# Altium project NC1-1BA.PrjPcb (part 2 of 2)

## Sheet Power.SchDoc: On / Off Controller
size A3; SheetNumber: 7; SheetTotal: 7
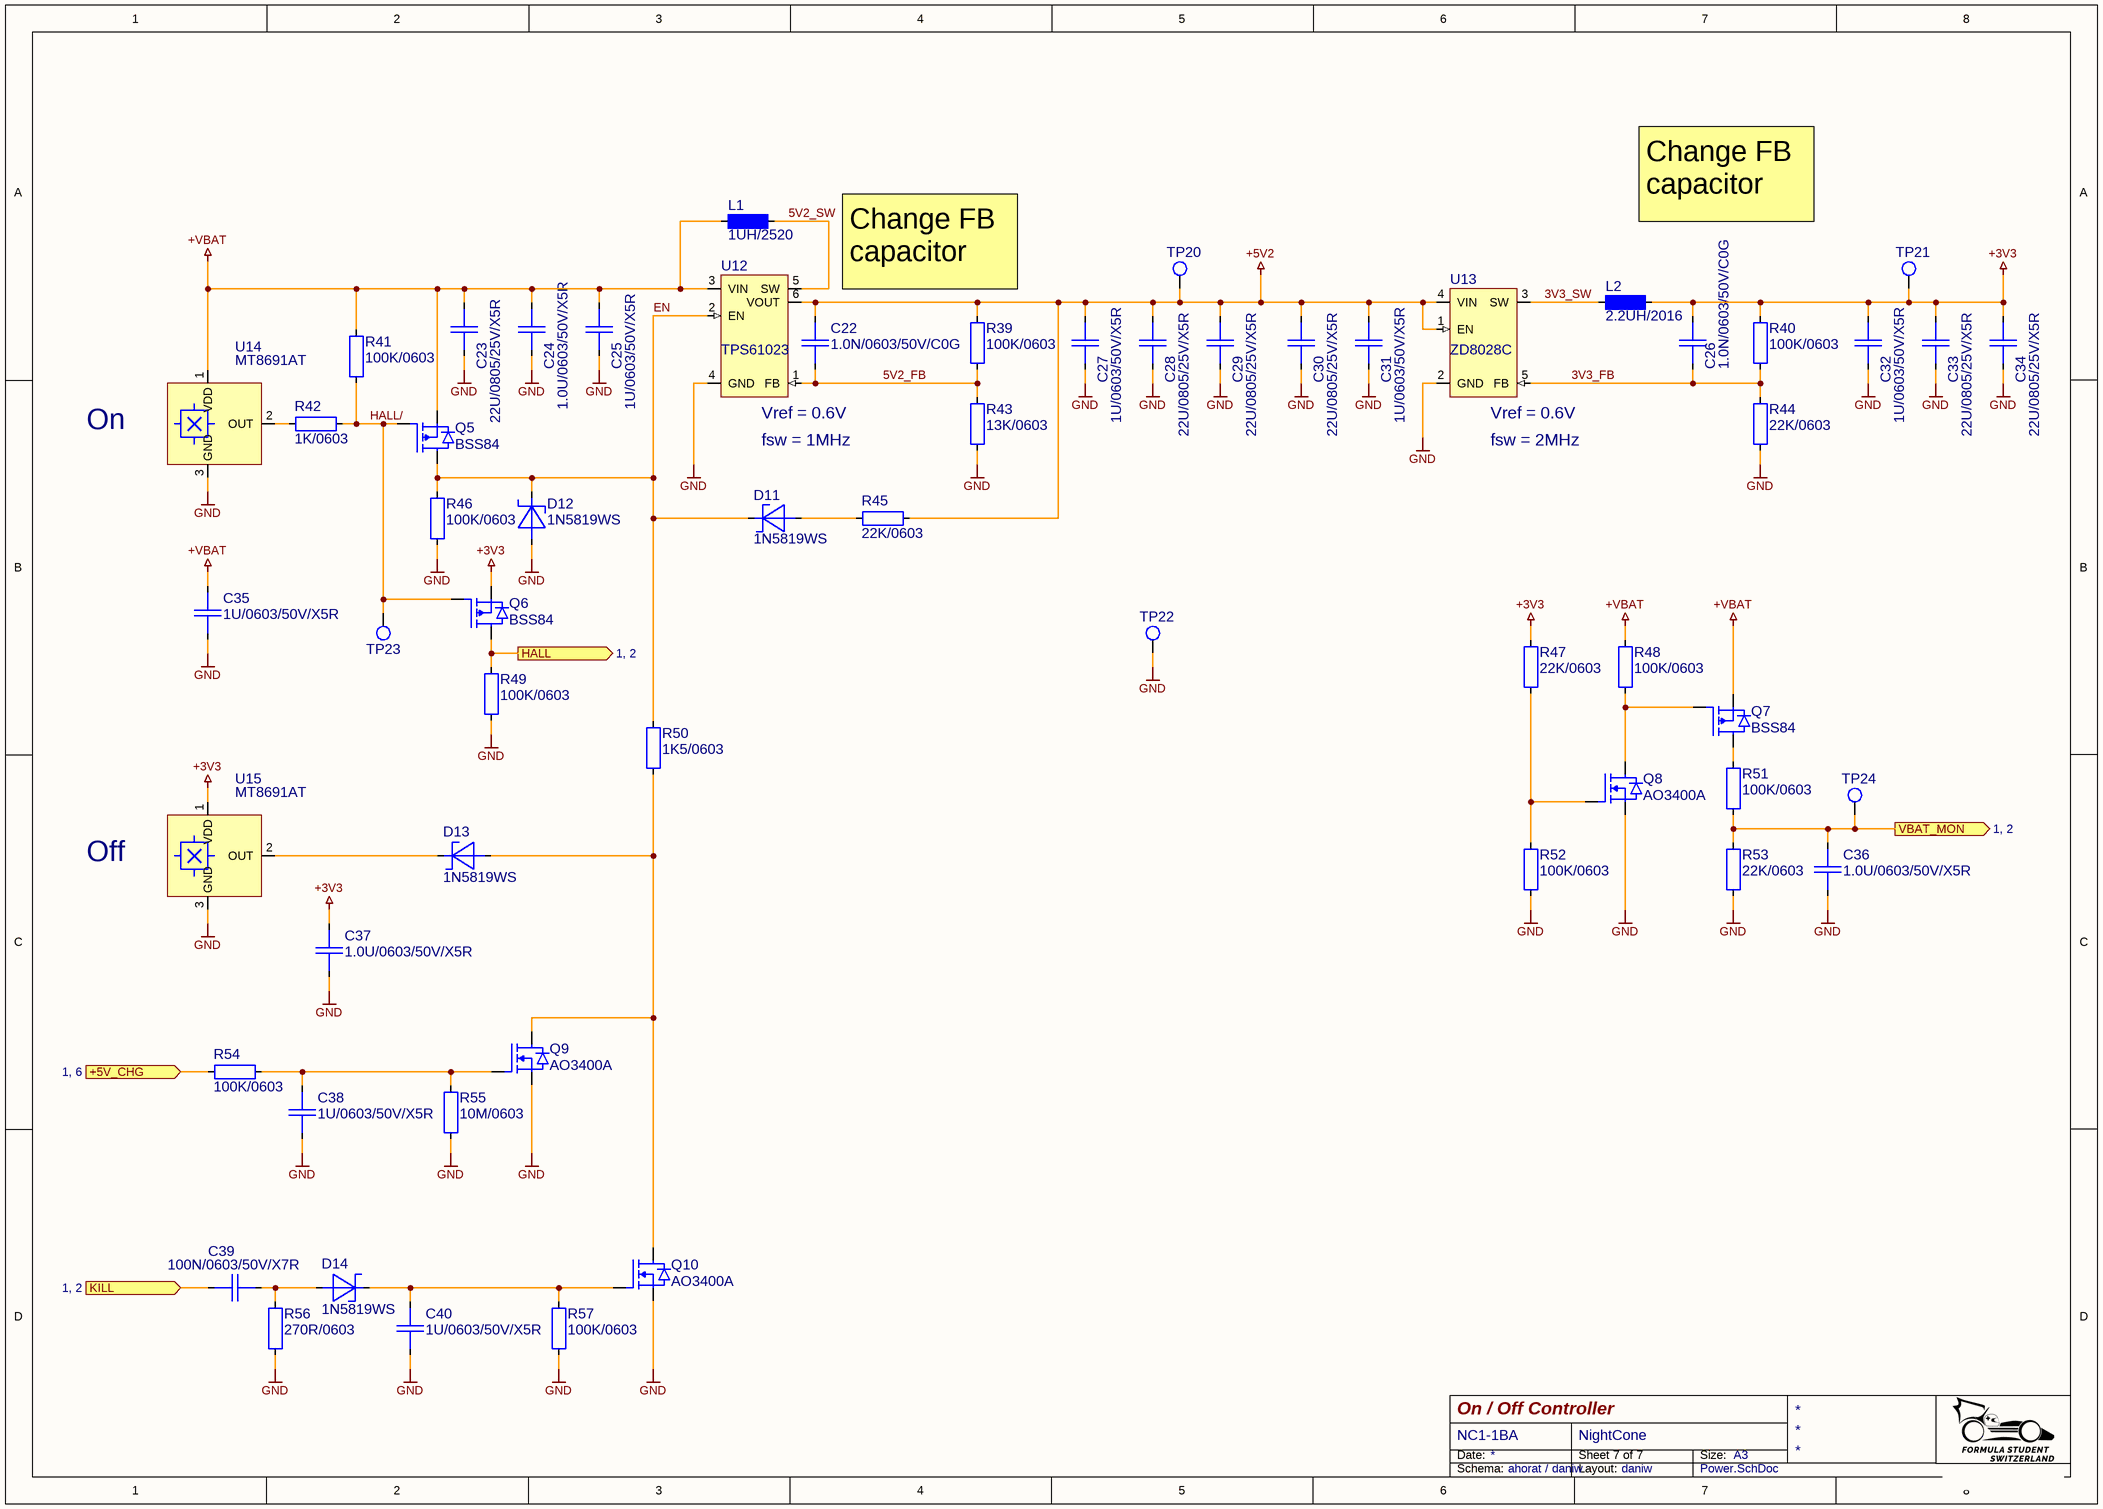
[diagram p6: Power.SchDoc]

### Parts
C22  1.0N/0603/50V/C0G  [CAP0603_C0G]
C23  22U/0805/25V/X5R  [CAP0805_X7R]
C24  1.0U/0603/50V/X5R  [CAP0603_X7R]
C25  1U/0603/50V/X5R  [CAP0603_X7R]
C26  1.0N/0603/50V/C0G  [CAP0603_C0G]
C27  1U/0603/50V/X5R  [CAP0603_X7R]
C28  22U/0805/25V/X5R  [CAP0805_X7R]
C29  22U/0805/25V/X5R  [CAP0805_X7R]
C30  22U/0805/25V/X5R  [CAP0805_X7R]
C31  1U/0603/50V/X5R  [CAP0603_X7R]
C32  1U/0603/50V/X5R  [CAP0603_X7R]
C33  22U/0805/25V/X5R  [CAP0805_X7R]
C34  22U/0805/25V/X5R  [CAP0805_X7R]
C35  1U/0603/50V/X5R  [CAP0603_X7R]
C36  1.0U/0603/50V/X5R  [CAP0603_X7R]
C37  1.0U/0603/50V/X5R  [CAP0603_X7R]
C38  1U/0603/50V/X5R  [CAP0603_X7R]
C39  100N/0603/50V/X7R  [CAP0603_X7R]
C40  1U/0603/50V/X5R  [CAP0603_X7R]
D11  1N5819WS  [SOD2513X100]
D12  1N5819WS  [SOD2513X100]
D13  1N5819WS  [SOD2513X100]
D14  1N5819WS  [SOD2513X100]
L1  1UH/2520  [INDM2520X10]
L2  2.2UH/2016  [INDM2016X10]
Q5  BSS84  [SOT2395P280X125-3-SE]
Q6  BSS84  [SOT2395P280X125-3-SE]
Q7  BSS84  [SOT2395P280X125-3-SE]
Q8  AO3400A  [SOT2395P280X125-3-SE]
Q9  AO3400A  [SOT2395P280X125-3-SE]
Q10  AO3400A  [SOT2395P280X125-3-SE]
R39  100K/0603  [R0603-0.40-WW]
R40  100K/0603  [R0603-0.40-WW]
R41  100K/0603  [R0603-0.40-WW]
R42  1K/0603  [R0603-0.40-WW]
R43  13K/0603  [R0603-0.40-WW]
R44  22K/0603  [R0603-0.40-WW]
R45  22K/0603  [R0603-0.40-WW]
R46  100K/0603  [R0603-0.40-WW]
R47  22K/0603  [R0603-0.40-WW]
R48  100K/0603  [R0603-0.40-WW]
R49  100K/0603  [R0603-0.40-WW]
R50  1K5/0603  [R0603-0.40-WW]
R51  100K/0603  [R0603-0.40-WW]
R52  100K/0603  [R0603-0.40-WW]
R53  22K/0603  [R0603-0.40-WW]
R54  100K/0603  [R0603-0.40-WW]
R55  10M/0603  [R0603-0.40-WW]
R56  270R/0603  [R0603-0.40-WW]
R57  100K/0603  [R0603-0.40-WW]
TP20  TP_THD_1.5/0.8  [TP_THD_1.5/0.8]  (value not drawn)  (no BOM)
TP21  TP_THD_1.5/0.8  [TP_THD_1.5/0.8]  (value not drawn)  (no BOM)
TP22  TP_THD_1.5/0.8  [TP_THD_1.5/0.8]  (value not drawn)  (no BOM)
TP23  TP_THD_1.5/0.8  [TP_THD_1.5/0.8]  (value not drawn)  (no BOM)
TP24  TP_THD_1.5/0.8  [TP_THD_1.5/0.8]  (value not drawn)  (no BOM)
U12  TPS61023  [SOT50P160X60-6-SE]
U13  ZD8028C  [SOT2395P280X125-5-SW]
U14  MT8691AT  [SOT2395P280X125-3-SE]
U15  MT8691AT  [SOT2395P280X125-3-SE]

### Ports
+5V_CHG (in, see 1, 6), HALL (out, see 1, 2), KILL (in, see 1, 2), VBAT_MON (out, see 1, 2)

### Nets
+3V3: C26.1 C32.2 C33.1 C34.1 C37.1 L2.2 Q6.2(SOURCE) R40.1 R47.1 TP21.1 U15.1(VDD)
+5V2: C22.1 C27.2 C28.1 C29.1 C30.1 C31.2 R39.1 R45.2 TP20.1 U12.6(VOUT) U13.1(EN) U13.4(VIN)
+VBAT: C23.1 C24.2 C25.2 C35.1 L1.1 Q5.2(SOURCE) Q7.2(SOURCE) R41.1 R48.1 U12.3(VIN) U14.1(VDD)
GND: C23.2 C24.1 C25.1 C27.1 C28.2 C29.2 C30.2 C31.1 C32.1 C33.2 C34.2 C35.2 C36.2 C37.2 C38.2 C40.2 D12.2 Q8.2(SOURCE) Q9.2(SOURCE) Q10.2(SOURCE) R43.1 R44.2 R46.2 R49.2 R52.2 R53.2 R55.2 R56.2 R57.2 TP22.1 U12.4(GND) U13.2(GND) U14.3(GND) U15.3(GND)
3V3_FB: C26.2 R40.2 R44.1 U13.5(FB)
3V3_SW: L2.1 U13.3(SW)
5V2_FB: C22.2 R39.2 R43.2 U12.1(FB)
5V2_SW: L1.2 U12.5(SW)
+5V_CHG: R54.1 ; port +5V_CHG
EN: D11.1 D12.1 Q5.3(DRAIN) R46.1 R50.1 U12.2(EN)
HALL: Q6.3(DRAIN) R49.1 ; port HALL
HALL/: Q5.1(GATE) Q6.1(GATE) R41.2 R42.2 TP23.1
KILL: C39.1 ; port KILL
VBAT_MON: C36.1 R51.2 R53.1 TP24.1 ; port VBAT_MON
NetC38_1: C38.1 Q9.1(GATE) R54.2 R55.1
NetC39_2: C39.2 D14.2 R56.1
NetC40_1: C40.1 D14.1 Q10.1(GATE) R57.1
NetD11_2: D11.2 R45.1
NetD13_1: D13.1 U15.2(OUT)
NetD13_2: D13.2 Q9.3(DRAIN) Q10.3(DRAIN) R50.2
NetQ7_1: Q7.1(GATE) Q8.3(DRAIN) R48.2
NetQ7_3: Q7.3(DRAIN) R51.1
NetQ8_1: Q8.1(GATE) R47.2 R52.1
NetR42_1: R42.1 U14.2(OUT)

### Notes on the sheet
- Change FB capacitor
- On
- (near U12) Vref = 0.6V
- fsw = 1MHz
- (near U13) Vref = 0.6V
- (near U13) fsw = 2MHz
- Off
- Date:
- Size:
- A3
- Schema:
- Layout:

### Library data of the parts
C22 C26 = 1.0N/0603/50V/C0G: CAP SM 0603 1.0nF 50V C0G; Manufacturer: GENERIC; Manufacturer 1: YAGEO; Manufacturer Part Number 1: CC0603JRNPO9BN102; Absolute Value: 1E-9; Eurocircuits GPN: GPC0603102-C0G; Part Number: 1.0N/0603/50V/C0G; Package: 0603; Value: 1.0nF; HelpURL: https://www.yageo.com/upload/media/product/productsearch/datasheet/mlcc/UPY-GP_NP0_16V-to-50V_18.pdf; Supplier 1: Digi-Key; Supplier Part Number 1: 311-1423-1-ND; Manufacturer 2: YAGEO; Manufacturer Part Number 2: CC0603KRNPO9BN102; Supplier 2: Digi-Key; Supplier Part Number 2: 311-4026-1-ND
C23 C28-C30 C33 C34 = 22U/0805/25V/X5R: CAP SM 0805 22uF 25V X5R; Manufacturer: GENERIC; Absolute Value: 2.2E-5; Part Number: 22U/0805/25V/X5R; Package: 805; Value: 22uF; Manufacturer Part Number 3: CL21A226MAQNNNE; Supplier 3: LCSC; Supplier Part Number 3: C45783; JLC Type: Basic
C24 C36 C37 = 1.0U/0603/50V/X5R: CAP SM 0603 1.0uF 50V X5R; Manufacturer: GENERIC; Manufacturer 1: Samsung Electro-Mechanics; Manufacturer Part Number 1: CL10A105KB8NNNC; Absolute Value: 1E-6; Eurocircuits GPN: GPC0603105-X5R; Part Number: 1.0U/0603/50V/X5R; Package: 0603; Value: 1.0uF; Manufacturer Part Number 3: CL10A105KB8NNNC; Supplier 3: LCSC; Supplier Part Number 3: C15849; JLC Type: Basic; HelpURL: https://mm.digikey.com/Volume0/opasdata/d220001/medias/docus/658/CL10A105KB8NNNC_Spec.pdf; Supplier 1: Digi-Key; Supplier Part Number 1: 1276-1860-1-ND
C25 C27 C31 C32 C35 C38 C40 = 1U/0603/50V/X5R: CAP SM 0603 1.0uF 50V X5R; Manufacturer: GENERIC; Absolute Value: 1E-6; Part Number: 1U/0603/50V/X5R; Package: 603; Value: 1.0uF; Manufacturer Part Number 3: CL10A105KB8NNNC; Supplier 3: LCSC; Supplier Part Number 3: C15849; JLC Type: Basic
C39 = 100N/0603/50V/X7R: CAP SM 0603 100nF 50V X7R; Manufacturer: GENERIC; Manufacturer 1: YAGEO; Manufacturer Part Number 1: CC0603KPX7R9BB104; Absolute Value: 1E-7; Part Number: 100N/0603/50V/X7R; Package: 603; Value: 100nF; HelpURL: https://www.yageo.com/upload/media/product/app/datasheet/mlcc/upy-gphc_x7r_6_3v-to-250v.pdf; Supplier 1: Digi-Key; Supplier Part Number 1: 311-3567-1-ND; Manufacturer 2: YAGEO; Manufacturer Part Number 2: CC0603MRX7R9BB104; Supplier 2: Digi-Key; Supplier Part Number 2: 311-4110-1-ND; Manufacturer Part Number 3: CC0603KRX7R9BB104; Supplier 3: LCSC; Supplier Part Number 3: C14663; JLC Type: Basic
D11-D14 = 1N5819WS: 40V 600mV@1A 1A SOD-323 Schottky Barrier Diodes (SBD) ROHS; Manufacturer: GENERIC; Part Number: 1N5819WS; Package: SOD323; Value: 1N5819WS; Absolute Value: 40V; HelpURL: https://datasheet.lcsc.com/lcsc/2204281430_Guangdong-Hottech-1N5819WS_C191023.pdf; Manufacturer 3: Guangdong Hottech; Manufacturer Part Number 3: 1N5819WS; Supplier 3: LCSC; Supplier Part Number 3: C191023; JLC Type: Basic
L1 = 1UH/2520: 1UH 2520 Shielded Inductor SMD; Manufacturer: GENERIC; Manufacturer 1: INPAQ Technology Co., Ltd; Manufacturer Part Number 1: WIP252010S-1R0MLDG; Absolute Value: 1E-6; Part Number: 1UH/2520; Package: 2520 metric; Value: 1UH; HelpURL: https://mm.digikey.com/Volume0/opasdata/d220001/medias/docus/5561/WIP252010S%20L%20Series.pdf; Supplier 1: Digi-Key; Supplier Part Number 1: 3526-WIP252010S-1R0MLDGCT-ND; Manufacturer 3: INPAQ; Manufacturer Part Number 3: WIP252012P-1R0ML; Supplier 3: LCSC; Supplier Part Number 3: C315711; JLC Type: Extended
L2 = 2.2UH/2016: 2.2UH 2016 Shielded Inductor SMD; Manufacturer: GENERIC; Manufacturer 1: INPAQ Technology Co., Ltd; Manufacturer Part Number 1: WIP201610S-2R2MLDG; Absolute Value: 2.2E-6; Part Number: 2.2UH/2016; Package: 2016 metric; Value: 2.2UH; HelpURL: https://mm.digikey.com/Volume0/opasdata/d220001/medias/docus/5561/WIP201610S%20L%20Series.pdf; Supplier 1: Digi-Key; Supplier Part Number 1: 3526-WIP201610S-2R2MLDGCT-ND; Manufacturer 3: INPAQ; Manufacturer Part Number 3: WIP201610P-2R2ML; Supplier 3: LCSC; Supplier Part Number 3: C315717; JLC Type: Extended
Q5-Q7 = BSS84: 50V P-Channel MOSFET; Manufacturer: GENERIC; Manufacturer 1: Good-Ark Semiconductor; Part Number: BSS84; Package: SOT23; HelpURL: https://goodarksemi.com/docs/datasheets/mosfets/BSS84.pdf; Manufacturer Part Number 1: BSS84; Supplier 1: Digi-Key; Supplier Part Number 1: 4786-BSS84CT-ND; Manufacturer 3: Jiangsu Changjing Electronics Technology Co., Ltd.; Manufacturer Part Number 3: BSS84; Supplier 3: LCSC; Supplier Part Number 3: C114481; JLC Type: Extended
Q8-Q10 = AO3400A: 30V N-Channel MOSFET; Manufacturer: Alpha & Omega Semiconductor; Part Number: AO3400A; Package: SOT23; HelpURL: https://aosmd.com/res/data_sheets/AO3400A.pdf; Manufacturer 3: Alpha & Omega Semiconductor; Manufacturer Part Number 3: AO3400A; Supplier 3: LCSC; Supplier Part Number 3: C20917; JLC Type: Basic
R39-R41 R46 R48 R49 R51 R52 R54 R57 = 100K/0603: RES SM 0603 100K; Manufacturer: GENERIC; Manufacturer 1: YAGEO; Manufacturer Part Number 1: RC0603FR-13100KL; Absolute Value: 100000; Part Number: 100K/0603; Package: 0603; Value: 100K; HelpURL: https://www.yageo.com/upload/media/product/productsearch/datasheet/rchip/PYu-RC_Group_51_RoHS_L_12.pdf; Supplier 1: Digi-Key; Supplier Part Number 1: 13-RC0603FR-13100KLCT-ND; Manufacturer 2: YAGEO; Manufacturer Part Number 2: RC0603FR-10100KL; Supplier 2: Digi-Key; Supplier Part Number 2: 13-RC0603FR-10100KLCT-ND; Manufacturer 3: UNI-ROYAL(Uniroyal Elec); Manufacturer Part Number 3: 0603WAF1003T5E; Supplier 3: LCSC; Supplier Part Number 3: C25803; JLC Type: Basic
R42 = 1K/0603: RES SM 0603 1K; Manufacturer: GENERIC; Manufacturer 1: YAGEO; Manufacturer Part Number 1: RC0603FR-131KL; Absolute Value: 1000; Eurocircuits GPN: GPR06031K; Part Number: 1K/0603; Package: 0603; Value: 1K; HelpURL: https://www.yageo.com/upload/media/product/app/datasheet/rchip/pyu-rc_group_51_rohs_l.pdf; Supplier 1: Digi-Key; Supplier Part Number 1: 13-RC0603FR-131KLCT-ND; Manufacturer 2: YAGEO; Manufacturer Part Number 2: RC0603FR-101KL; Supplier 2: Digi-Key; Supplier Part Number 2: 13-RC0603FR-101KLCT-ND; Manufacturer 3: UNI-ROYAL(Uniroyal Elec); Manufacturer Part Number 3: 0603WAF1001T5E; Supplier 3: LCSC; Supplier Part Number 3: C21190; JLC Type: Basic
R43 = 13K/0603: RES SM 0603 13K; Manufacturer: GENERIC; Manufacturer 1: YAGEO; Manufacturer Part Number 1: RC0603FR-1313KL; Absolute Value: 13000; Part Number: 13K/0603; Package: 0603; Value: 13K; HelpURL: https://www.yageo.com/upload/media/product/productsearch/datasheet/rchip/PYu-RC_Group_51_RoHS_L_12.pdf; Supplier 1: Digi-Key; Supplier Part Number 1: 13-RC0603FR-1313KLCT-ND; Manufacturer 2: YAGEO; Manufacturer Part Number 2: RC0603FR-1013KL; Supplier 2: Digi-Key; Supplier Part Number 2: 13-RC0603FR-1013KLCT-ND; Manufacturer 3: UNI-ROYAL(Uniroyal Elec); Manufacturer Part Number 3: 0603WAF1302T5E; Supplier 3: LCSC; Supplier Part Number 3: C22797; JLC Type: Basic
R44 R45 R47 R53 = 22K/0603: RES SM 0603 22K; Manufacturer: GENERIC; Manufacturer 1: YAGEO; Manufacturer Part Number 1: RC0603FR-1322KL; Absolute Value: 22000; Part Number: 22K/0603; Package: 0603; Value: 22K; HelpURL: https://www.yageo.com/upload/media/product/app/datasheet/rchip/pyu-rc_group_51_rohs_l.pdf; Supplier 1: Digi-Key; Supplier Part Number 1: 13-RC0603FR-1322KLCT-ND; Manufacturer 2: YAGEO; Manufacturer Part Number 2: RC0603FR-1022KL; Supplier 2: Digi-Key; Supplier Part Number 2: 13-RC0603FR-1022KLCT-ND; Manufacturer 3: UNI-ROYAL(Uniroyal Elec); Manufacturer Part Number 3: 0603WAF2202T5E; Supplier 3: LCSC; Supplier Part Number 3: C31850; JLC Type: Basic
R50 = 1K5/0603: RES SM 0603 1K5; Manufacturer: GENERIC; Manufacturer 1: YAGEO; Manufacturer Part Number 1: RC0603FR-131K5L; Absolute Value: 1500; Part Number: 1K5/0603; Package: 0603; Value: 1K5; HelpURL: https://www.yageo.com/upload/media/product/app/datasheet/rchip/pyu-rc_group_51_rohs_l.pdf; Supplier 1: Digi-Key; Supplier Part Number 1: 13-RC0603FR-131K5LCT-ND; Manufacturer 2: YAGEO; Manufacturer Part Number 2: RC0603FR-101K5L; Supplier 2: Digi-Key; Supplier Part Number 2: 13-RC0603FR-101K5LCT-ND; Manufacturer 3: UNI-ROYAL(Uniroyal Elec); Manufacturer Part Number 3: 0603WAF1501T5E; Supplier 3: LCSC; Supplier Part Number 3: C22843; JLC Type: Basic
R55 = 10M/0603: RES SM 0603 10M; Manufacturer: GENERIC; Manufacturer 1: YAGEO; Manufacturer Part Number 1: RC0603FR-1310ML; Absolute Value: 10000000; Part Number: 10M/0603; Package: 603; Value: 10M; HelpURL: https://www.yageo.com/upload/media/product/productsearch/datasheet/rchip/PYu-RC_Group_51_RoHS_L_12.pdf; Supplier 1: Digi-Key; Supplier Part Number 1: 13-RC0603FR-1310MLCT-ND; Manufacturer 2: YAGEO; Manufacturer Part Number 2: RC0603FR-1010ML; Supplier 2: Digi-Key; Supplier Part Number 2: 13-RC0603FR-1010MLCT-ND; Manufacturer 3: UNI-ROYAL(Uniroyal Elec); Manufacturer Part Number 3: 0603WAF1005T5E; Supplier 3: LCSC; Supplier Part Number 3: C7250; JLC Type: Basic
R56 = 270R/0603: RES SM 0603 270R; Manufacturer: GENERIC; Manufacturer 1: YAGEO; Manufacturer Part Number 1: RC0603FR-13270RL; Absolute Value: 270; Part Number: 270R/0603; Package: 0603; Value: 270R; HelpURL: https://www.yageo.com/upload/media/product/productsearch/datasheet/rchip/PYu-RC_Group_51_RoHS_L_12.pdf; Supplier 1: Digi-Key; Supplier Part Number 1: 13-RC0603FR-13270RLCT-ND; Manufacturer 2: YAGEO; Manufacturer Part Number 2: RC0603FR-10270RL; Supplier 2: Digi-Key; Supplier Part Number 2: 13-RC0603FR-10270RLCT-ND; Manufacturer 3: UNI-ROYAL(Uniroyal Elec); Manufacturer Part Number 3: 0603WAF2700T5E; Supplier 3: LCSC; Supplier Part Number 3: C22966; JLC Type: Basic
TP20-TP24 = TP_THD_1.5/0.8: THT Test Point 1.5/0.8mm; Manufacturer: NONE; Part Number: TP_THD_1.5/0.8
U12 = TPS61023: 3.7-A Boost Converter with 0.5-V Ultra-low Input Voltage; Manufacturer: Texas Instruments; Part Number: TPS61023; Package: SOT563; HelpURL: https://www.ti.com/lit/ds/symlink/tps61023.pdf; Manufacturer 1: Texas Instruments; Manufacturer Part Number 1: TPS61023; Supplier 1: Digi-Key; Supplier Part Number 1: 296-TPS61023DRLRTR-ND; Manufacturer 3: Texas Instruments; Manufacturer Part Number 3: TPS61023; Supplier 3: LCSC; Supplier Part Number 3: C919459; JLC Type: Extended
U13 = ZD8028C: 1.5A 2MHz 5.5V Synchronous Buck Converter; Manufacturer: Zetta; Part Number: ZD8028C; Package: SOT23-5; HelpURL: https://datasheet.lcsc.com/lcsc/2203221830_Zetta-ZD8028IB5TR_C2928932.pdf; Manufacturer 3: Zetta; Manufacturer Part Number 3: ZD8028IB5TR; Supplier 3: LCSC; Supplier Part Number 3: C2928932; JLC Type: Extended
U14 U15 = MT8691AT: MT8691AT Uni-polar, Nano Power Hall-Effect Switch IC; Manufacturer: Magn Tek; Part Number: MT8691AT; Package: SOT23; HelpURL: https://www.lcsc.com/datasheet/lcsc_datasheet_2304140030_Magn-Tek-MT8691AT_C879625.pdf; Manufacturer 3: Magn Tek; Manufacturer Part Number 3: MT8691AT; Supplier 3: LCSC; Supplier Part Number 3: C879625; JLC Type: Extended

## Nets that join several sheets
+3V3: Control (14 pins), Power (11 pins)
+5V2: FailSafe (15 pins), Lights (C17.1 R28.1 U9.2), Lights/LED0 (C14_LED0.1 R26_LED0.1 U8_LED0.2), Lights/LED1 (C14_LED1.1 R26_LED1.1 U8_LED1.2), Lights/LED2 (C14_LED2.1 R26_LED2.1 U8_LED2.2), Lights/LED3 (C14_LED3.1 R26_LED3.1 U8_LED3.2), Lights/LED4 (C14_LED4.1 R26_LED4.1 U8_LED4.2), Lights/LED5 (C14_LED5.1 R26_LED5.1 U8_LED5.2), Lights/LED6 (C14_LED6.1 R26_LED6.1 U8_LED6.2), Lights/LED7 (C14_LED7.1 R26_LED7.1 U8_LED7.2), Lights/LED8 (C14_LED8.1 R26_LED8.1 U8_LED8.2), Lights/LED9 (C14_LED9.1 R26_LED9.1 U8_LED9.2), Lights/LED10 (C14_LED10.1 R26_LED10.1 U8_LED10.2), Lights/LED11 (C14_LED11.1 R26_LED11.1 U8_LED11.2), Lights/LED12 (C14_LED12.1 R26_LED12.1 U8_LED12.2), Lights/LED13 (C14_LED13.1 R26_LED13.1 U8_LED13.2), Lights/LED14 (C14_LED14.1 R26_LED14.1 U8_LED14.2), Lights/LED15 (C14_LED15.1 R26_LED15.1 U8_LED15.2), Lights/LED16 (C14_LED16.1 R26_LED16.1 U8_LED16.2), Lights/LED17 (C14_LED17.1 R26_LED17.1 U8_LED17.2), Lights/LED18 (C14_LED18.1 R26_LED18.1 U8_LED18.2), Power (12 pins)
+VBAT: Charger (6 pins), Power (11 pins)
GND: Control (15 pins), FailSafe (19 pins), Lights (C16.2 C17.2 U9.5), Lights/LED0 (C14_LED0.2 C15_LED0.2 U8_LED0.5 U8_LED0.6), Lights/LED1 (C14_LED1.2 C15_LED1.2 U8_LED1.5), Lights/LED2 (C14_LED2.2 C15_LED2.2 U8_LED2.5), Lights/LED3 (C14_LED3.2 C15_LED3.2 U8_LED3.5), Lights/LED4 (C14_LED4.2 C15_LED4.2 U8_LED4.5), Lights/LED5 (C14_LED5.2 C15_LED5.2 U8_LED5.5), Lights/LED6 (C14_LED6.2 C15_LED6.2 U8_LED6.5), Lights/LED7 (C14_LED7.2 C15_LED7.2 U8_LED7.5), Lights/LED8 (C14_LED8.2 C15_LED8.2 U8_LED8.5), Lights/LED9 (C14_LED9.2 C15_LED9.2 U8_LED9.5), Lights/LED10 (C14_LED10.2 C15_LED10.2 U8_LED10.5), Lights/LED11 (C14_LED11.2 C15_LED11.2 U8_LED11.5), Lights/LED12 (C14_LED12.2 C15_LED12.2 U8_LED12.5), Lights/LED13 (C14_LED13.2 C15_LED13.2 U8_LED13.5), Lights/LED14 (C14_LED14.2 C15_LED14.2 U8_LED14.5), Lights/LED15 (C14_LED15.2 C15_LED15.2 U8_LED15.5), Lights/LED16 (C14_LED16.2 C15_LED16.2 U8_LED16.5), Lights/LED17 (C14_LED17.2 C15_LED17.2 U8_LED17.5), Lights/LED18 (C14_LED18.2 C15_LED18.2 U8_LED18.5), Charger (15 pins), Power (34 pins)
+5V_CHG: Charger (10 pins), Power (R54.1)
B1: Lights/LED0 (R27_LED0.2 R28_LED0.2), Lights/LED1 (U8_LED1.6)
B2: Lights/LED1 (R27_LED1.2 R28_LED1.2), Lights/LED2 (U8_LED2.6)
B3: Lights/LED2 (R27_LED2.2 R28_LED2.2), Lights/LED3 (U8_LED3.6)
B4: Lights/LED3 (R27_LED3.2 R28_LED3.2), Lights/LED4 (U8_LED4.6)
B5: Lights/LED4 (R27_LED4.2 R28_LED4.2), Lights/LED5 (U8_LED5.6)
B6: Lights/LED5 (R27_LED5.2 R28_LED5.2), Lights/LED6 (U8_LED6.6)
B7: Lights/LED6 (R27_LED6.2 R28_LED6.2), Lights/LED7 (U8_LED7.6)
B8: Lights/LED7 (R27_LED7.2 R28_LED7.2), Lights/LED8 (U8_LED8.6)
B9: Lights/LED8 (R27_LED8.2 R28_LED8.2), Lights/LED9 (U8_LED9.6)
B10: Lights/LED9 (R27_LED9.2 R28_LED9.2), Lights/LED10 (U8_LED10.6)
B11: Lights/LED10 (R27_LED10.2 R28_LED10.2), Lights/LED11 (U8_LED11.6)
B12: Lights/LED11 (R27_LED11.2 R28_LED11.2), Lights/LED12 (U8_LED12.6)
B13: Lights/LED12 (R27_LED12.2 R28_LED12.2), Lights/LED13 (U8_LED13.6)
B14: Lights/LED13 (R27_LED13.2 R28_LED13.2), Lights/LED14 (U8_LED14.6)
B15: Lights/LED14 (R27_LED14.2 R28_LED14.2), Lights/LED15 (U8_LED15.6)
B16: Lights/LED15 (R27_LED15.2 R28_LED15.2), Lights/LED16 (U8_LED16.6)
B17: Lights/LED16 (R27_LED16.2 R28_LED16.2), Lights/LED17 (U8_LED17.6)
B18: Lights/LED17 (R27_LED17.2 R28_LED17.2), Lights/LED18 (U8_LED18.6)
B19: Lights (U9.6), Lights/LED18 (R27_LED18.2 R28_LED18.2)
CHG_A: NC1-1-Top (J1.1), Charger (D2.2 D8.1 TP15.1)
CHG_B: NC1-1-Top (J2.1), Charger (D3.2 D9.1 TP16.1)
CHG_C: NC1-1-Top (J3.1), Charger (D4.2 D10.1 TP17.1)
D1: Lights/LED0 (U8_LED0.3), Lights/LED1 (R28_LED1.1 U8_LED1.4)
D2: Lights/LED1 (U8_LED1.3), Lights/LED2 (R28_LED2.1 U8_LED2.4)
D3: Lights/LED2 (U8_LED2.3), Lights/LED3 (R28_LED3.1 U8_LED3.4)
D4: Lights/LED3 (U8_LED3.3), Lights/LED4 (R28_LED4.1 U8_LED4.4)
D5: Lights/LED4 (U8_LED4.3), Lights/LED5 (R28_LED5.1 U8_LED5.4)
D6: Lights/LED5 (U8_LED5.3), Lights/LED6 (R28_LED6.1 U8_LED6.4)
D7: Lights/LED6 (U8_LED6.3), Lights/LED7 (R28_LED7.1 U8_LED7.4)
D8: Lights/LED7 (U8_LED7.3), Lights/LED8 (R28_LED8.1 U8_LED8.4)
D9: Lights/LED8 (U8_LED8.3), Lights/LED9 (R28_LED9.1 U8_LED9.4)
D10: Lights/LED9 (U8_LED9.3), Lights/LED10 (R28_LED10.1 U8_LED10.4)
D11: Lights/LED10 (U8_LED10.3), Lights/LED11 (R28_LED11.1 U8_LED11.4)
D12: Lights/LED11 (U8_LED11.3), Lights/LED12 (R28_LED12.1 U8_LED12.4)
D13: Lights/LED12 (U8_LED12.3), Lights/LED13 (R28_LED13.1 U8_LED13.4)
D14: Lights/LED13 (U8_LED13.3), Lights/LED14 (R28_LED14.1 U8_LED14.4)
D15: Lights/LED14 (U8_LED14.3), Lights/LED15 (R28_LED15.1 U8_LED15.4)
D16: Lights/LED15 (U8_LED15.3), Lights/LED16 (R28_LED16.1 U8_LED16.4)
D17: Lights/LED16 (U8_LED16.3), Lights/LED17 (R28_LED17.1 U8_LED17.4)
D18: Lights/LED17 (U8_LED17.3), Lights/LED18 (R28_LED18.1 U8_LED18.4)
D19: Lights (U9.4), Lights/LED18 (U8_LED18.3)
DATA: Control (R3.2 TP1.1), FailSafe (Q1.1 R22.2)
DATA_FS: FailSafe (J5.1 R24.2 TP11.1), Lights/LED0 (R28_LED0.1 U8_LED0.4)
HALL: Control (M1.4), Power (Q6.3 R49.1)
KILL: Control (R9.2 TP5.1), Power (C39.1)
VBAT_MON: Control (U2.3), Power (C36.1 R51.2 R53.1 TP24.1)

## Assembly variants
WS2813B-B: not fitted Q2 R1 R2 R6 R7 R8 R27 R30 R33 R36 R39 R42 R45 R48 R51 R54 R57 R60 R63 R66 R69 R72 R75 R78 R81; alternate parts U8 -> WS2813B-B, U15 -> WS2813B-B, U16 -> WS2813B-B, U17 -> WS2813B-B, U18 -> WS2813B-B, U19 -> WS2813B-B, U20 -> WS2813B-B, U21 -> WS2813B-B, U22 -> WS2813B-B, U23 -> WS2813B-B, U24 -> WS2813B-B, U25 -> WS2813B-B, U26 -> WS2813B-B, U9 -> WS2813B-B, U10 -> WS2813B-B, U11 -> WS2813B-B, U12 -> WS2813B-B, U13 -> WS2813B-B, U14 -> WS2813B-B
WS2813B-V5: not fitted C15 C17 C19 C21 C23 C25 C27 C29 C31 C33 C35 C37 C39 C41 C43 C45 C47 C49 C51 C52 Q2 R1 R2 R6 R7 R8 R26 R28 R29 R31 R32 R34 R35 R37 R38 R40 R41 R43 R44 R46 R47 R49 R50 R52 R53 R55 R56 R58 R59 R61 R62 R64 R65 R67 R68 R70 R71 R73 R74 R76 R77 R79 R80 R82 R83; alternate parts R23 -> 910R/0603, R25 -> 1K2/0603, U8 -> WS2813B-V5, U9 -> WS2813B-V5, U16 -> WS2813B-V5, U17 -> WS2813B-V5, U18 -> WS2813B-V5, U19 -> WS2813B-V5, U20 -> WS2813B-V5, U22 -> WS2813B-V5, U23 -> WS2813B-V5, U21 -> WS2813B-V5, U25 -> WS2813B-V5, U26 -> WS2813B-V5, U24 -> WS2813B-V5, U10 -> WS2813B-V5, U13 -> WS2813B-V5, U12 -> WS2813B-V5, U14 -> WS2813B-V5, U15 -> WS2813B-V5, U11 -> WS2813B-V5
WS2813C: not fitted Q2 R1 R2 R6 R7 R8 R27 R30 R33 R36 R39 R42 R45 R48 R51 R54 R57 R60 R63 R66 R69 R72 R75 R78 R81; alternate parts U8 -> WS2813C, U15 -> WS2813C, U16 -> WS2813C, U17 -> WS2813C, U18 -> WS2813C, U19 -> WS2813C, U20 -> WS2813C, U21 -> WS2813C, U22 -> WS2813C, U23 -> WS2813C, U24 -> WS2813C, U25 -> WS2813C, U26 -> WS2813C, U9 -> WS2813C, U10 -> WS2813C, U11 -> WS2813C, U12 -> WS2813C, U13 -> WS2813C, U14 -> WS2813C
WS2813E: not fitted C15 C17 C19 C21 C23 C25 C27 C29 C31 C33 C35 C37 C39 C41 C43 C45 C47 C49 C51 C52 Q2 R1 R2 R6 R7 R8 R26 R27 R29 R30 R32 R33 R35 R36 R38 R39 R41 R42 R44 R45 R47 R48 R50 R51 R53 R54 R56 R57 R59 R60 R62 R63 R65 R66 R68 R69 R71 R72 R74 R75 R77 R78 R80 R81 R83; alternate parts U8 -> WS2813E, U15 -> WS2813E, U16 -> WS2813E, U17 -> WS2813E, U18 -> WS2813E, U19 -> WS2813E, U20 -> WS2813E, U21 -> WS2813E, U22 -> WS2813E, U23 -> WS2813E, U24 -> WS2813E, U25 -> WS2813E, U26 -> WS2813E, U9 -> WS2813E, U10 -> WS2813E, U11 -> WS2813E, U12 -> WS2813E, U13 -> WS2813E, U14 -> WS2813E